# EasyEDA Pro project ProPrj_HEMY 2.0_2025-04-23.epro, schematic Schematic2_1
Board Name: USB pin extender; Create Date: 2025-03-09; Page Name: P1; Project Name: AstraNode; Schematic Name: Schematic2_1; Update Date: 2025-03-09; Company: EasyEDA.com; Page Size: A4; Version: V1.0
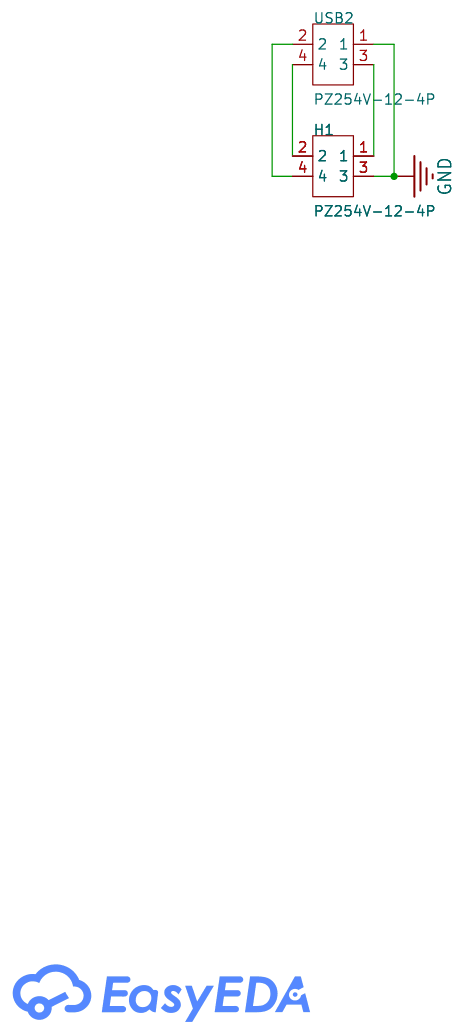
[diagram p3: schematic sheet]

## Parts
H1  PZ254V-12-4P  [HDR-TH_4P-P2.54-V-M-R2-C2-S2.54]  (no BOM)
USB2  PZ254V-12-4P  [HDR-TH_4P-P2.54-V-M-R2-C2-S2.54]  (no BOM)

## Library data of the parts
H1 USB2 = PZ254V-12-4P: Pin Structure:2x2P Pitch:2.54mm Row Spacing:2.54mm Circluar Pins/Square Pins:Policy Mounting Type:Straight Number of Rows:Double Row Number of Pins:4P Current Rating:- Voltage Rating (Max):- Length of Mating Pin:6mm Insulation Height:2.5mm Length of End C; LCSC Part Name: 2x2P 间距:2.54mm 方针 直插; Supplier Part: C492419; Manufacturer: XFCN(兴飞); Supplier Footprint: 插件,P=2.54mm; JLCPCB Part Class: Extended Part; Datasheet: https://atta.szlcsc.com/upload/public/pdf/source/20200309/C492419_0001C06E73AFF21BD0ED3D7CEEF46D29.pdf; Supplier: LCSC; Pin Structure: 2x2P; Pitch: 2.54mm; Row Spacing: 2.54mm; Circluar Pins/Square Pins: Policy; Mounting Type: Straight; Number of Rows: Double Row; Number of Pins: 4P; Length of Mating Pin: 6mm; Insulation Height: 2.5mm; Length of End Connection Pin: 3mm; Contact Material: Brass; Operating Temperature: -40℃~+105℃; Color: Black

## Nets
GND: H1.3 USB2.1
$1N537: H1.4 USB2.2
$1N559: H1.2 USB2.4
$1N563: H1.1 USB2.3
